# Altium schematic sheet Communications.SchDoc
size A4; SheetNumber: 8
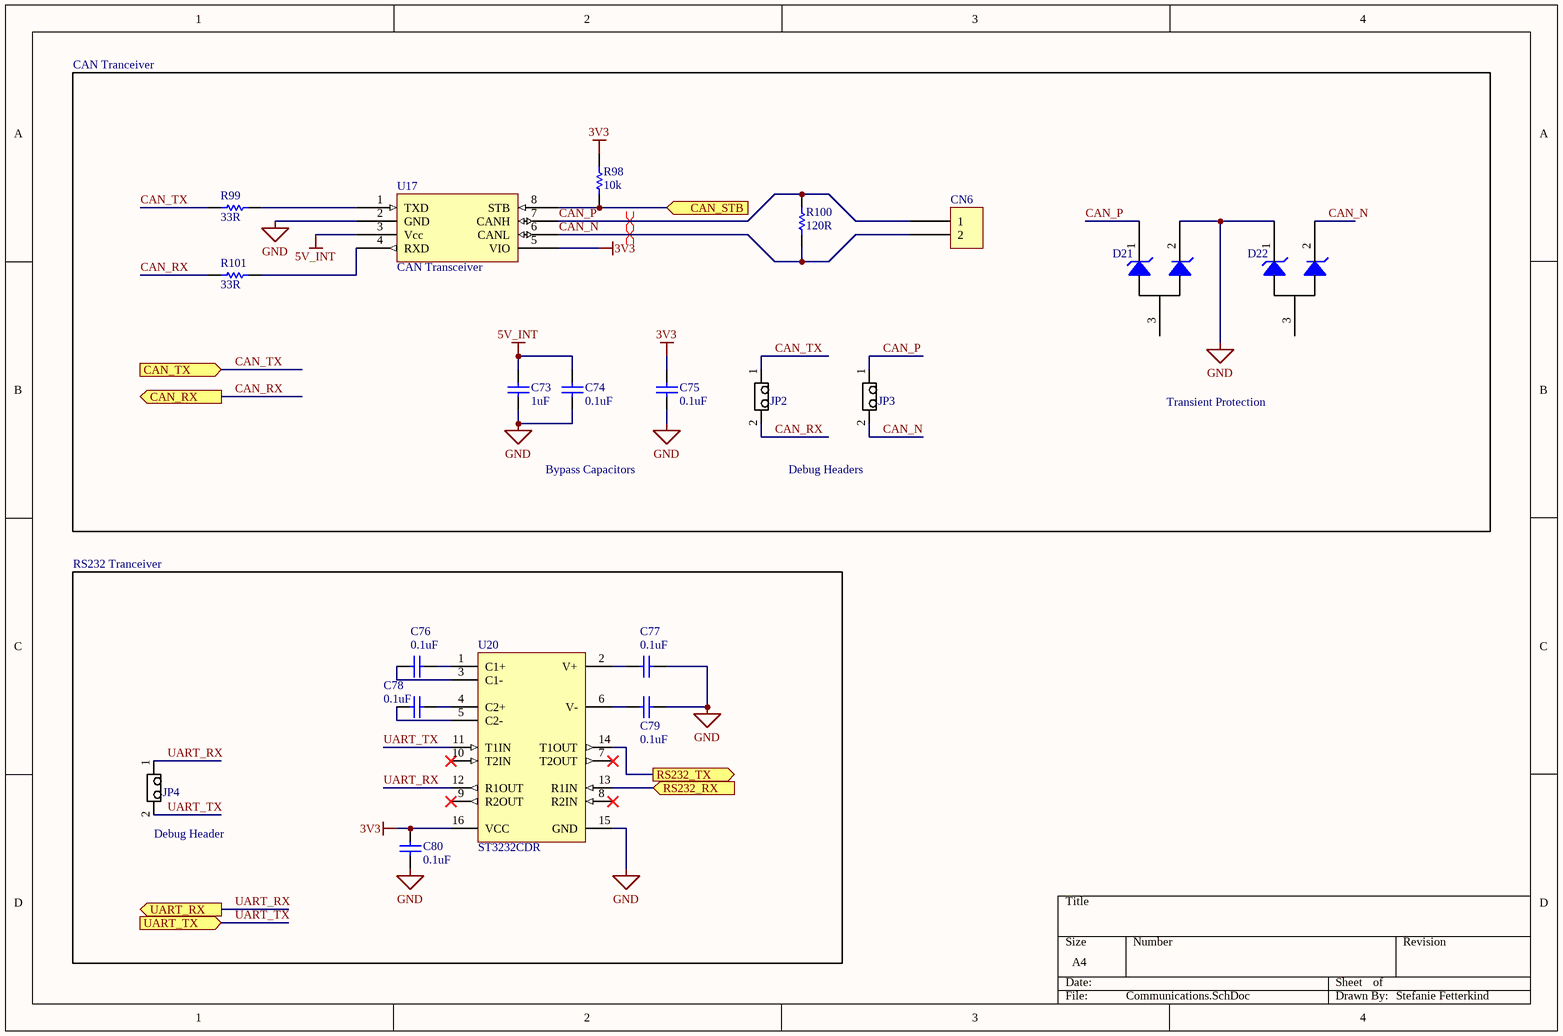
[diagram p0: Communications.SchDoc]

## Parts
C73  Capacitance: 1uF  [0803 CAP]  (hidden comment: CL21B105KBFNNNG)
C74  Capacitance: 0.1uF  [FP-CL10-0_1-IPC_A]  (hidden comment: CL10B104JB8NNNC)
C75  Capacitance: 0.1uF  [FP-CL10-0_1-IPC_A]  (hidden comment: CL10B104JB8NNNC)
C76  Capacitance: 0.1uF  [FP-CL10-0_1-IPC_A]  (hidden comment: CL10B104JB8NNNC)
C77  Capacitance: 0.1uF  [FP-CL10-0_1-IPC_A]  (hidden comment: CL10B104JB8NNNC)
C78  Capacitance: 0.1uF  [FP-CL10-0_1-IPC_A]  (hidden comment: CL10B104JB8NNNC)
C79  Capacitance: 0.1uF  [FP-CL10-0_1-IPC_A]  (hidden comment: CL10B104JB8NNNC)
C80  Capacitance: 0.1uF  [FP-CL10-0_1-IPC_A]  (hidden comment: CL10B104JB8NNNC)
CN6  1x2 Shrouded Right Angle  [2X1 Female Header]  (value not drawn)
D21  PESD36VS2UT,215  [SOT95P245X110-3N]  (value not drawn)
D22  PESD36VS2UT,215  [SOT95P245X110-3N]  (value not drawn)
JP2  1x2 Male Header  [2X1 Males Header]  (value not drawn)
JP3  1x2 Male Header  [2X1 Males Header]  (value not drawn)
JP4  1x2 Male Header  [2X1 Males Header]  (value not drawn)
R98  value 10k  [RESC1608N(0603")]  (hidden comment: 10kR, 1%, 1/10W, 0603 SMD)
R99  Resistance: 33R  [RESC1608X55X25ML10T15]  (hidden comment: RC0603FR-0733RL)
R100  Resistance: 120R  [RESC1608X55X25ML10T15]  (hidden comment: RC0603FR-07120RL)
R101  Resistance: 33R  [RESC1608X55X25ML10T15]  (hidden comment: RC0603FR-0733RL)
U17  CAN Transceiver  [8-SOIC]
U20  ST3232CDR  [STM-SO-16_M]

## Ports
CAN_RX (out), CAN_STB (in), CAN_TX (in), RS232_RX (in), RS232_TX (out), UART_RX (out), UART_TX (in)

## Nets
3V3: C75.1 C80.2 R98.2 U17.5(VIO) U20.16(VCC)
5V_INT: C73.1 C74.1 U17.3(Vcc)
GND: C73.2 C74.2 C75.2 C77.2 C79.2 C80.1 D21.2(Cathode_2) D22.1(Cathode_1) U17.2(GND) U20.15(GND)
CAN_N: CN6.2 D22.2(Cathode_2) JP3.2 R100.1 U17.6(CANL)
CAN_P: CN6.1 D21.1(Cathode_1) JP3.1 R100.2 U17.7(CANH)
CAN_RX: JP2.2 R101.2 ; port CAN_RX
CAN_STB: R98.1 U17.8(STB) ; port CAN_STB
CAN_TX: JP2.1 R99.2 ; port CAN_TX
RS232_RX: U20.13(R1IN) ; port RS232_RX
RS232_TX: U20.14(T1OUT) ; port RS232_TX
UART_RX: JP4.1 U20.12(R1OUT) ; port UART_RX
UART_TX: JP4.2 U20.11(T1IN) ; port UART_TX
NetC76_1: C76.1 U20.3(C1-)
NetC76_2: C76.2 U20.1(C1+)
NetC77_1: C77.1 U20.2(V+)
NetC78_1: C78.1 U20.5(C2-)
NetC78_2: C78.2 U20.4(C2+)
NetC79_1: C79.1 U20.6(V-)
NetR99_1: R99.1 U17.1(TXD)
NetR101_1: R101.1 U17.4(RXD)

Not connected (* = marked no-connect by the designer): D21 3(Common_Anode); D22 3(Common_Anode); U20 7(T2OUT)* 8(R2IN)* 9(R2OUT)* 10(T2IN)*

## Layout directives
differential pair: CAN_N, CAN_P

## Notes on the sheet
- CAN Tranceiver
- Transient Protection
- Bypass Capacitors
- Debug Headers
- RS232 Tranceiver
- (near JP4) Debug Header
- Stefanie Fetterkind

## Library data of the parts
C73 = CMP-00005-3: SAMSUNG ELECTRO-MECHANICS - CL21B105KBFNNNG - MLCC CAPACITORS; Tolerance: 10%; Voltage Rating: 50V; Material: Ceramic; Dielectric: X7R; Case/Package: 0805; Contact Plating: Tin; Max Operating Temperature: 125°C; Termination: Wraparound; Package Quantity: 3000; Depth: 1.25mm; Mount: Surface Mount; Min Operating Temperature: -55°C; Thickness: 0.053inch; Packaging: Tape and Reel; Voltage: 50V; Case Code (Metric): 2012; Length: 2mm; Case Code (Imperial): 0805; Width: 0.049inch
C74-C80 = CMP-00000-4: CAP CER 0.1UF 50V X7R 0603; Tolerance: 5%; Material: Ceramic; Case Code (Imperial): 0603; Mount: Surface Mount; Thickness: 0.035inch; Depth: 0.8mm; Packaging: Tape and Reel; Package Quantity: 1; Dielectric: X7R; Height: 0.8mm; Voltage: 50V; Radiation Hardening: No; Max Operating Temperature: 125°C; Voltage Rating: 50V; Case/Package: 0603; Min Operating Temperature: -55°C; Case Code (Metric): 1608; Length: 1.6mm; Contact Plating: Tin; Width: 0.031inch
CN6 = CMP-00010-3: 02 MTE HDR SRRA LATCH; PCB Mount Retention: Without; Number of Positions: 2; Row Spacing: 0.1inch; Contact Retention: Yes (With); PCB Mount Alignment: No (Without); Current Rating: 3A; PCB Thickness: 0.062inch; Insulation Resistance: 5GR; Gender: Male; Connector Type: Plug,Header,Pin; Tail Length: 3.3mm; Approvals: CSA; Pitch: 2.54mm; Contact Resistance: 15mR; Color: Black; REACH SVHC: Unknown; Contact Shape: Square; Number of Contacts: 2; PCB Mounting Orientation: Right Angle; Housing Material: Thermoplastic; Max Operating Temperature: 105°C; Mount: Through Hole; Package Quantity: 68; Contact Current Rating: 3A; Housing Color: Black; Contact Material: Brass; Min Operating Temperature: -65°C; Packaging: Rail/Tube; Height: 13.59mm; ELV: Compliant; Number of Rows: 1; Orientation: Right Angle; Lead Free: Lead Free; Mating Retention: Yes (With); Strain Relief: No (Without); Length: 7.62mm; Flammability Rating: UL94 V-0; Contact Plating: Gold,Tin,Matte; Contact Mating Length: 0.23inch; Contact Gender: Male; Termination: Crimp; Backwall/Post Interruptions: No (Without); Depth: 13.59mm; Mating Alignment: Yes (With)
D21 D22 = CMP-058-0000-2: TVS DIODE 36V 60V SOT23; Date Created: 2020-05-18; Created By: Miguel Manguerra; Design Item ID: PESD36VS2UT,215; Component Type: Standard; Pin Count: 3; Source: AUVic_Schematic_Library_Diodes.SchLib
JP2-JP4 = CMP-004-0001-1: Made By: Andy Bates; Source: AUVic_Schematic_Library_Connectors.SchLib; Pin Count: 2; Design Item ID: 1x2 Male Header; Component Type: Standard
R98 = CMP-047-0013-1: Owned By: AUVic; Made By: Ashwin Sira; Design Item ID: 10kR, 1%, 1/10W, 0603 SMD; Pin Count: 2; Component Type: Standard; Created On: 14-05-31; Last Edited: 14-05-31; Source: AUVic_Schematic_Library_Resistors.SchLib
R99 R101 = CMP-00060-2: Res Thick Film 0603 33 Ohm 1% 1/10W +/-100ppm/ßC Molded SMD Paper T/R; Max Power Dissipation: 100mW; Voltage Rating: 75V; Voltage Rating (DC): 50V; Temperature Coefficient: 100ppm/°C; Depth: 0.8mm; Military Standard: Not; Min Operating Temperature: -55°C; Termination: SMD/SMT; Weight: 7.1E-05oz; Number of Terminations: 2; Height: 0.45mm; Power Rating: 100mW; Composition: Thick Film; Length: 1.6mm; Packaging: Tape and Reel; Lead Pitch: 0.3mm; Lead Free: Lead Free; Max Operating Temperature: 155°C; REACH SVHC: No SVHC; Features: Moisture Resistant; Tolerance: 1%; Case/Package: 0603; Package Quantity: 1; Width: 0.8mm; Case Code (Metric): 1608; Number of Pins: 2; Case Code (Imperial): 0603
R100 = CMP-00061-2: Res Thick Film 0603 120 Ohm 1% 0.1W(1/10W) ±100ppm/C Epoxy SMD T/R; Power Rating: 100mW; Voltage Rating (DC): 50V; Temperature Coefficient: 100ppm/°C; Depth: 0.8mm; Max Operating Temperature: 155°C; Case/Package: 0603; Lead Free: Lead Free; Height: 0.022inch; Length: 1.6mm; Case Code (Metric): 1608; Package Quantity: 1; Features: Moisture Resistant; Termination: SMD/SMT; Military Standard: Not; Number of Pins: 2; Width: 0.031inch; REACH SVHC: No SVHC; Max Power Dissipation: 100mW; Min Operating Temperature: -55°C; Packaging: Tape and Reel; Composition: Thick Film; Tolerance: 1%; Voltage Rating: 50V; Number of Terminations: 2; Case Code (Imperial): 0603
U17 = CMP-032-0000-2: 1/1 Transceiver Half CANbus 8-SO; Data Rate: 1Mbps; Max Supply Voltage: 5.5V; Propagation Delay: 250ns; Number of Transceivers: 1; Nominal Supply Current: 70mA; Min Supply Voltage: 4.5V; Min Operating Temperature: -40°C; Radiation Hardening: No; Packaging: Tape and Reel; Turn-On Delay Time: 250ns; Case/Package: SO; Contact Plating: Gold; Package Quantity: 2500; Number of Pins: 8; Max Supply Current: 70mA; Max Operating Temperature: 150°C; Interface: CAN; Mount: Surface Mount; Lead Free: Lead Free
U20 = CMP-00015-1: Dual Transmitter/Receiver RS-232 16-Pin SO T/R; Data Rate: 400Kbps; Max Supply Current: 2mA; Number of Drivers: 2; Nominal Supply Current: 300uA; ESD Protection: No; Max Supply Voltage: 5.5V; Output Voltage: 5.4V; Number of Transceivers: 1; Min Supply Voltage: 3V; Logic Function: Receiver; Contact Plating: Tin,Matte; REACH SVHC: No SVHC; Min Operating Temperature: 0°C; Height: 1.65mm; Packaging: Tape and Reel; Lead Free: Lead Free; Number of Receivers: 2; Number of Pins: 16; Length: 10mm; Number of Transmitters: 2; Case/Package: SOIC; Width: 4mm; Package Quantity: 1; Interface: RS-232; Mount: Surface Mount; Radiation Hardening: No; Max Operating Temperature: 70°C